# EAGLE schematic carret (EAGLE 5.11)
A: a
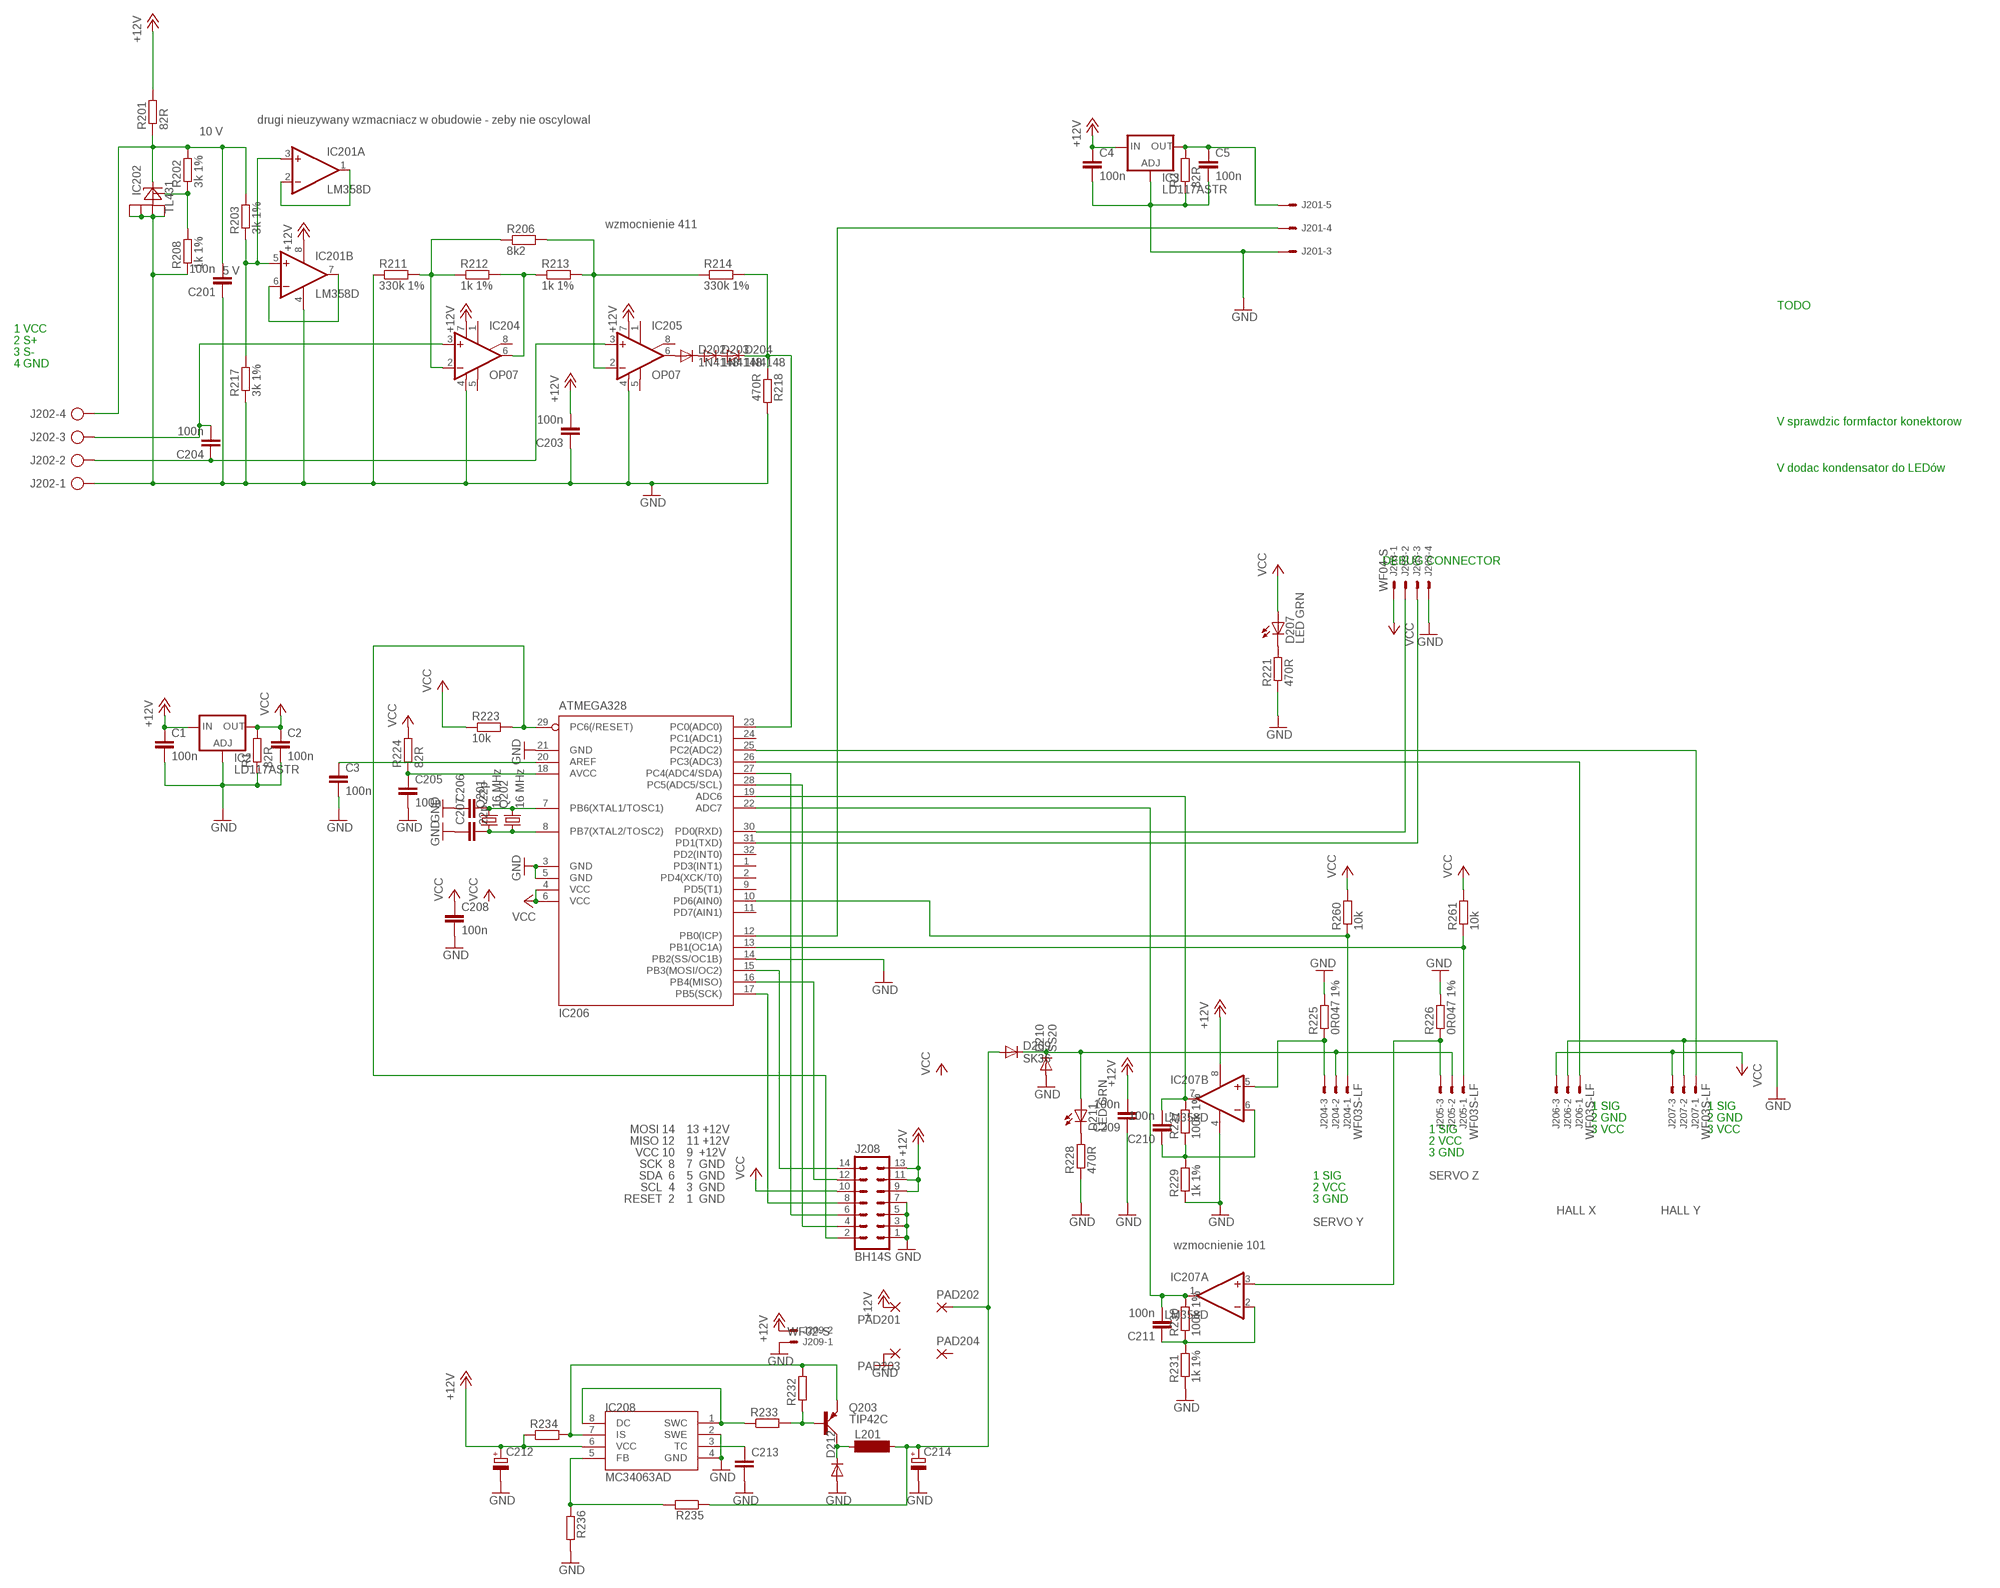
[diagram p0: schematic, sheet 1]

## Parts
C1  100n  CAP  [0805]
C2  100n  CAP  [0805]
C3  100n  CAP  [0805]
C4  100n  CAP  [0805]
C5  100n  CAP  [0805]
C201  100n  CAP  [0805]
C203  100n  CAP  [0805]
C204  100n  CAP  [0805]
C205  100n  CAP  [0805]
C206  22p  CAP  [0805]
C207  22p  CAP  [0805]
C208  100n  CAP  [0805]
C209  100n  CAP  [0805]
C210  100n  CAP  [0805]
C211  100n  CAP  [0805]
C212  CPOL-EUE3.5-8  [E3,5-8]
C213  CAP  [0805]
C214  CPOL-EUE3.5-8  [E3,5-8]
D202  1N4148  DIODE-SOD80C  [SOD80C]
D203  1N4148  DIODE-SOD80C  [SOD80C]
D204  1N4148  DIODE-SOD80C  [SOD80C]
D207  LED GRN  LED  [0805_DIODE]
D209  SK36  DIODE-SMC  [SMC]
D210  SS20  DIODE-DO214AA  [DO214AA]
D211  LED GRN  LED  [0805_DIODE]
D212  DIODE-SMB  [SMB]
IC2  LD117ASTR  [SOT223]
IC3  LD117ASTR  [SOT223]
IC201  LM358D  [SO08]
IC202  TL431  [SO08]
IC204  OP07  OP07CR  [SO08]
IC205  OP07  OP07CR  [SO08]
IC206  ATMEGA328  MEGA8-AI  [TQFP32-08]
IC207  LM358D  [SO08]
IC208  MC34063AD  [SOIC8]
J201  22-27-2051-05  [6410-05]
J202  AK300/4  [AK300/4]
J203  WF04-S  22-27-2041-04  [6410-04]
J204  WF03S-LF  22-27-2031-03  [6410-03]
J205  WF03S-LF  22-27-2031-03  [6410-03]
J206  WF03S-LF  22-27-2031-03  [6410-03]
J207  WF03S-LF  22-27-2031-03  [6410-03]
J208  BH14S  ML14  [ML14]
J209  WF02-S  22-27-2021-02  [6410-02]
L201  BS75  [BS75]
PAD201  3,81/1,1  [3,81/1,1]
PAD202  3,81/1,1  [3,81/1,1]
PAD203  3,81/1,1  [3,81/1,1]
PAD204  3,81/1,1  [3,81/1,1]
Q201  16 MHz  CRYSTALHC49UP  [HC49UP]
Q202  16 MHz  CRYSTALHC49U-V  [HC49U-V]
Q203  TIP42C  [TO220AV]
R1  82R  RES0805  [0805]
R2  82R  RES0805  [0805]
R201  82R  RES0805  [0805]
R202  3k 1%  RES0805  [0805]
R203  3k 1%  RES0805  [0805]
R206  8k2  RES0805  [0805]
R208  1k 1%  RES0805  [0805]
R211  330k 1%  RES0805  [0805]
R212  1k 1%  RES0805  [0805]
R213  1k 1%  RES0805  [0805]
R214  330k 1%  RES0805  [0805]
R217  3k 1%  RES0805  [0805]
R218  470R  RES0805  [0805]
R221  470R  RES0805  [0805]
R223  10k  RES0805  [0805]
R224  82R  RES0805  [0805]
R225  0R047 1%  R-EU_R1206  [R1206]
R226  0R047 1%  R-EU_R1206  [R1206]
R227  100k 1%  RES0805  [0805]
R228  470R  RES0805  [0805]
R229  1k 1%  RES0805  [0805]
R230  100k 1%  RES0805  [0805]
R231  1k 1%  RES0805  [0805]
R232  RES0805  [0805]
R233  RES0805  [0805]
R234  RES0805  [0805]
R235  RES0805  [0805]
R236  RES0805  [0805]
R260  10k  RES0805  [0805]
R261  10k  RES0805  [0805]

## Nets
+6V: C214.+ D209.A L201.2 PAD202.1(P) R235.1
+10V: C201.2 IC202.1(K) J202.4 R201.1 R202.2 R203.2
+12V: C1.1 C4.1 C203.2 C209.2 C212.+ IC2.3(IN) IC3.3(IN) IC201.8(P:V+) IC204.7(V+) IC205.7(V+) IC207.8(P:V+) IC208.6(VCC) J208.9 J208.11 J208.13 J209.2 PAD201.1(P) R201.2 R234.1
GND: C1.2 C2.2 C3.2 C4.2 C5.2 C201.1 C203.1 C205.2 C206.1 C207.1 C208.2 C209.1 C212.- C213.2 C214.- D210.A D212.A IC2.1(ADJ) IC3.1(ADJ) IC201.4(P:V-) IC202.2(A) IC202.3(A1) IC202.6(A2) IC202.7(A3) IC204.4(V-) IC205.4(V-) IC206.3(GND) IC206.5(GND) IC206.14(PB2(SS/OC1B)) IC206.21(GND) IC207.4(P:V-) IC208.2(SWE) IC208.4(GND) J201.3 J202.1 J203.4 J206.2 J207.2 J208.1 J208.3 J208.5 J208.7 J209.1 PAD203.1(P) R1.1 R2.1 R208.1 R211.1 R217.1 R218.2 R221.1 R225.2 R226.2 R228.1 R229.1 R231.1 R236.2
MISO: IC206.16(PB4(MISO)) J208.12
MOSI: IC206.15(PB3(MOSI/OC2)) J208.14
N$1: IC201.6(B:-IN) IC201.7(B:OUT)
N$3: C5.1 IC3.4(OUT) J201.5 R2.2
N$11: D209.C D210.C D211.2(A) J204.2 J205.2
N$14: IC206.12(PB0(ICP)) J201.4
N$24: IC206.10(PD6(AIN0)) J204.1 R260.1
N$25: IC206.13(PB1(OC1A)) J205.1 R261.1
N$26: IC206.25(PC2(ADC2)) J207.1
N$27: C207.2 IC206.8(PB7(XTAL2/TOSC2)) Q201.1 Q202.1
N$28: IC206.26(PC3(ADC3)) J206.1
N$29: IC207.5(B:+IN) J204.3 R225.1
N$30: IC207.3(A:+IN) J205.3 R226.1
N$31: C211.2 IC206.22(ADC7) IC207.1(A:OUT) R230.2
N$37: C210.2 IC206.19(ADC6) IC207.7(B:OUT) R227.2
N$38: IC206.30(PD0(RXD)) J203.2
N$39: IC206.31(PD1(TXD)) J203.3
N$41: D204.C IC206.23(PC0(ADC0)) R214.2 R218.1
N$43: IC202.8(REF) R202.1 R208.2
N$46: C206.2 IC206.7(PB6(XTAL1/TOSC1)) Q201.2 Q202.2
N$47: D211.1(C) R228.2
N$48: C210.1 IC207.6(B:-IN) R227.1 R229.2
N$49: C204.2 IC204.3(+IN) J202.3
N$50: C204.1 IC205.3(+IN) J202.2
N$51: IC204.2(-IN) R206.1 R211.2 R212.1
N$52: IC204.6(OUT) R212.2 R213.1
N$53: IC205.2(-IN) R206.2 R213.2 R214.1
N$54: D202.A IC205.6(OUT)
N$55: D202.C D203.A
N$56: D203.C D204.A
N$57: C205.1 IC206.18(AVCC) R224.1
N$58: IC201.3(A:+IN) IC201.5(B:+IN) R203.1 R217.2
N$59: C3.1 IC206.20(AREF)
N$60: IC201.1(A:OUT) IC201.2(A:-IN)
N$61: C211.1 IC207.2(A:-IN) R230.1 R231.2
N$63: D207.1(C) R221.2
N$64: IC208.7(IS) Q203.E R232.2 R234.2
N$65: IC208.1(SWC) IC208.8(DC) R233.1
N$66: Q203.B R232.1 R233.2
N$67: C213.1 IC208.3(TC)
N$68: IC208.5(FB) R235.2 R236.1
N$71: D212.C L201.1 Q203.C
RESET: IC206.29(PC6(/RESET)) J208.2 R223.2
SCK: IC206.17(PB5(SCK)) J208.8
SCL: IC206.28(PC5(ADC5/SCL)) J208.4
SDA: IC206.27(PC4(ADC4/SDA)) J208.6
VCC: C2.1 C208.1 D207.2(A) IC2.4(OUT) IC206.4(VCC) IC206.6(VCC) J203.1 J206.3 J207.3 J208.10 R1.2 R223.1 R224.2 R260.2 R261.2
Unconnected: IC204.1(ON1) IC204.5(OPT) IC204.8(ON2) IC205.1(ON1) IC205.5(OPT) IC205.8(ON2) IC206.1(PD3(INT1)) IC206.2(PD4(XCK/T0)) IC206.9(PD5(T1)) IC206.11(PD7(AIN1)) IC206.24(PC1(ADC1)) IC206.32(PD2(INT0)) J201.1 J201.2 PAD204.1(P)

## Notes on the sheet
- drugi nieuzywany wzmacniacz w obudowie - zeby nie oscylowal
- 10 V
- wzmocnienie 411
- 5 V
- TODO
- 1 VCC
- 2 S+
- 3 S-
- 4 GND
- V sprawdzic formfactor konektorow
- V dodac kondensator do LEDów
- DEBUG CONNECTOR
- 1 SIG | 1 SIG
- 2 GND | 2 GND
- MOSI 14 | 13 +12V | 1 SIG | 3 VCC | 3 VCC
- MISO 12 | 11 +12V | 2 VCC
- VCC 10 | 9  +12V | 3 GND
- SCK  8 | 7  GND
- SDA  6 | 5  GND | 1 SIG | SERVO Z
- SCL  4 | 3  GND | 2 VCC
- RESET  2 | 1  GND | 3 GND
- HALL X | HALL Y
- SERVO Y
- wzmocnienie 101

## Library data of the parts
C1-C5 C201 C203-C211 C213 = barobot:CAP
C212 C214 = rcl:CPOL-EU: POLARIZED CAPACITOR, European symbol
D202-D204 D209 D210 D212 = diode:DIODE-: DIODE
D207 D211 = barobot:LED: LED rectangle, 5.7 x 3.2 mm
IC2 IC3 = v-reg:LD117A?*: Low drop fixed and adjustable positive voltage regulators 1 A Source: http://www.st.com/stonline/products/literature/ds/7194/ld1117axx.pdf
IC201 IC207 = linear:LM358: OP AMP also LM158; LM258; LM2904 Source: http://cache.national.com/ds/LM/LM158.pdf
IC202 = 0alib:TL431
IC204 IC205 = linear:OP07*: OP AMP
IC206 = atmel:MEGA8: MICROCONTROLLER 8 Kbytes FLASH, 1 kbytes SRAM, 512 bytes EEPROM, USART, 6-channel 10 bit ADC, 2-channel 8 bit ADC Pin compatible with Atmega48, ATMega88, ATMega168 Source: avr.lbr
IC208 = mc34063:MC34063
J201 = con-molex:22-?-05: CONNECTOR wire to board 2.54 mm (.1 inch) pitch header
J202 = con-ptr500:AK300/4: CONNECTOR
J203 = con-molex:22-?-04: CONNECTOR wire to board 2.54 mm (.1 inch) pitch header
J204-J207 = con-molex:22-?-03: CONNECTOR wire to board 2.54 mm (.1 inch) pitch header
J208 = con-ml:ML14: HARTING
J209 = con-molex:22-?-02: CONNECTOR wire to board 2.54 mm (.1 inch) pitch header
L201 = inductor-neosid:BS: INDUCTOR nominal inductance, magnetically screened
PAD201-PAD204 = wirepad:3,81/1,1: THROUGH-HOLE PAD
Q201 Q202 = crystal:CRYSTAL: CRYSTAL
Q203 = transistor-power:TIP42C: PNP TRANSISTOR
R1 R2 R201-R203 R206 R208 R211-R214 R217 R218 R221 R223 R224 R227-R236 R260 R261 = barobot:RES
R225 R226 = resistor:R-EU_: RESISTOR, European symbol